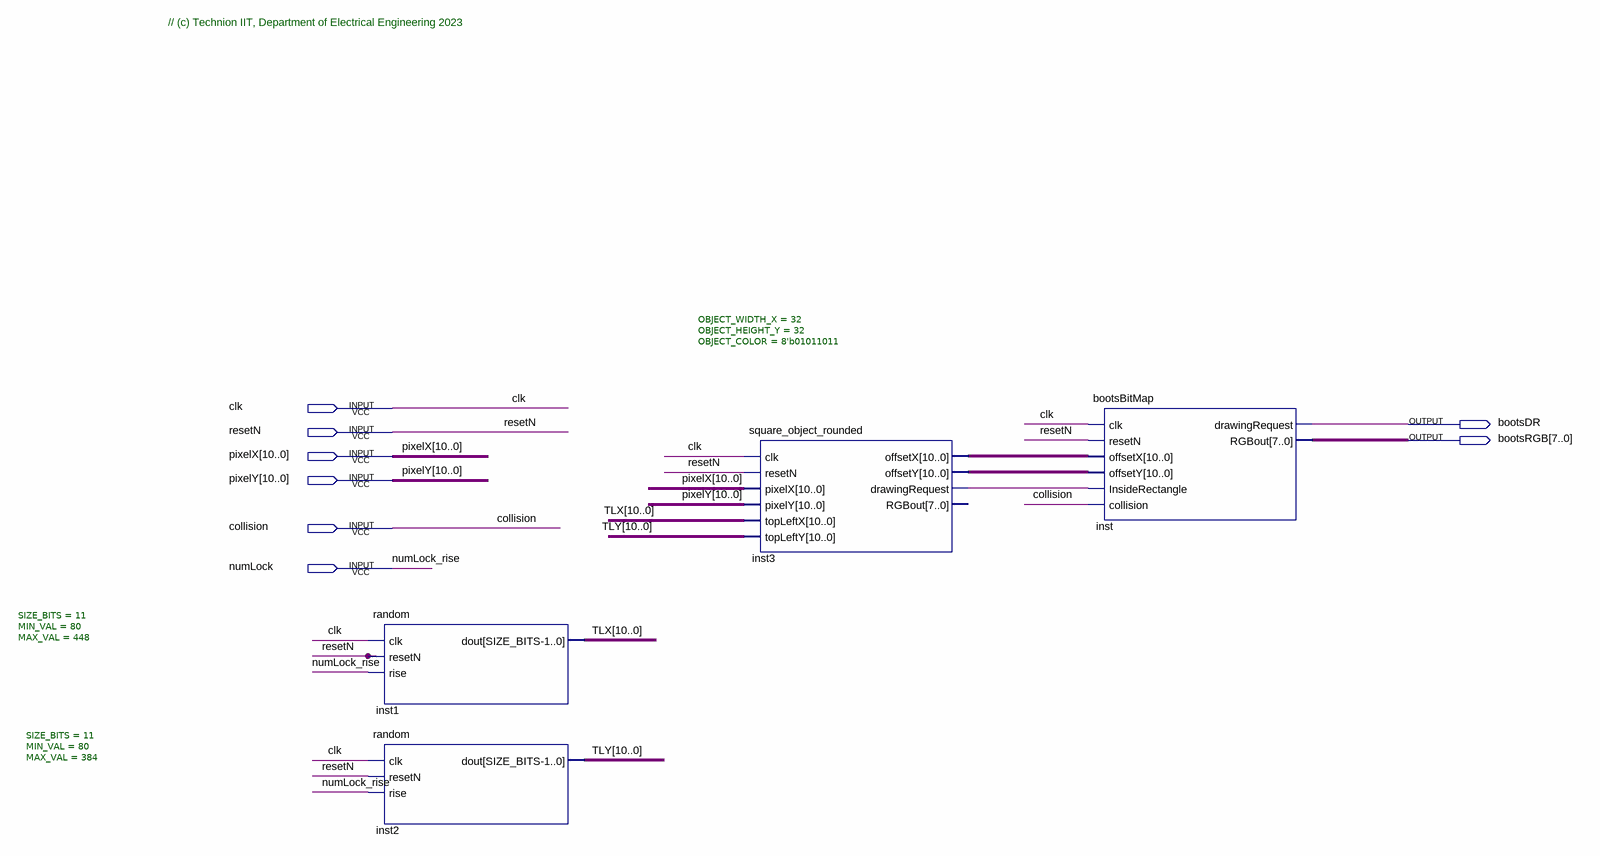
[diagram p0: schematic sheet]
// Quartus schematic Boots_Block_T.bdf as structural Verilog: 4 symbols, 8 pins
module Boots_Block_T (
  input  clk,
  input  resetN,
  input  [10:0] pixelX,
  input  [10:0] pixelY,
  input  collision,
  input  numLock,
  output bootsDR,
  output [7:0] bootsRGB
);

  wire inst3_drawingrequest;
  wire [10:0] inst3_offsetx, inst3_offsety, TLX, TLY;

  random #(.SIZE_BITS(11), .MIN_VAL(80), .MAX_VAL(448)) inst1 (.clk(clk), .resetN(resetN), .rise(numLock), .dout(TLX));
  random #(.SIZE_BITS(11), .MIN_VAL(80), .MAX_VAL(384)) inst2 (.clk(clk), .resetN(resetN), .rise(numLock), .dout(TLY));
  square_object_rounded #(.OBJECT_WIDTH_X(32), .OBJECT_HEIGHT_Y(32), .OBJECT_COLOR(8'b01011011)) inst3 (
    .clk(clk), .resetN(resetN), .pixelX(pixelX), .pixelY(pixelY), .topLeftX(TLX), .topLeftY(TLY),
    .offsetX(inst3_offsetx), .offsetY(inst3_offsety), .drawingRequest(inst3_drawingrequest));  // open: RGBout
  bootsBitMap inst (
    .clk(clk), .resetN(resetN), .offsetX(inst3_offsetx), .offsetY(inst3_offsety),
    .InsideRectangle(inst3_drawingrequest), .collision(collision), .drawingRequest(bootsDR), .RGBout(bootsRGB));

  // Other names for the same wires on the sheet: numLock_rise = numLock

  // Notes on the sheet:
  //   // (c) Technion IIT, Department of Electrical Engineering 2023
endmodule
